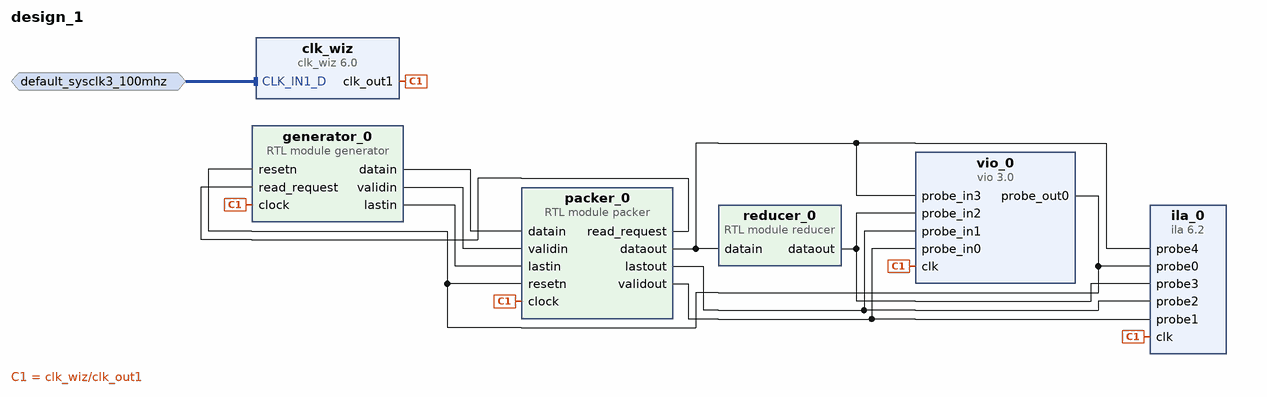
[diagram p0: block diagram of the top level]
# Vivado block design design_1, xczu28dr-ffvg1517-2-e, Vivado 2019.2
create_bd_design design_1

create_bd_intf_port -mode Slave -vlnv xilinx.com:interface:diff_clock_rtl:1.0 default_sysclk3_100mhz
set_property -dict {CONFIG.FREQ_HZ 100000000} [get_bd_intf_ports default_sysclk3_100mhz]

create_bd_cell -type ip -vlnv xilinx.com:ip:ila:6.2 ila_0
set_property -dict [list \
  CONFIG.C_ENABLE_ILA_AXI_MON false \
  CONFIG.C_MONITOR_TYPE Native \
  CONFIG.C_NUM_OF_PROBES 5 \
  CONFIG.C_PROBE3_WIDTH 4 \
  CONFIG.C_PROBE4_WIDTH 32 \
] [get_bd_cells ila_0]
create_bd_cell -type ip -vlnv xilinx.com:ip:clk_wiz:6.0 clk_wiz
set_property -dict [list \
  CONFIG.CLK_IN1_BOARD_INTERFACE default_sysclk3_100mhz \
  CONFIG.RESET_PORT resetn \
  CONFIG.RESET_TYPE ACTIVE_LOW \
  CONFIG.USE_BOARD_FLOW true \
  CONFIG.USE_LOCKED false \
  CONFIG.USE_RESET false \
] [get_bd_cells clk_wiz]
create_bd_cell -type module -reference packer packer_0
create_bd_cell -type module -reference generator generator_0
create_bd_cell -type ip -vlnv xilinx.com:ip:vio:3.0 vio_0
set_property -dict {CONFIG.C_EN_PROBE_IN_ACTIVITY 1 CONFIG.C_NUM_PROBE_IN 4} [get_bd_cells vio_0]
create_bd_cell -type module -reference reducer reducer_0

# ---- connections ----

connect_bd_intf_net [get_bd_intf_ports default_sysclk3_100mhz] [get_bd_intf_pins clk_wiz/CLK_IN1_D]
connect_bd_net [get_bd_pins clk_wiz/clk_out1] \
  [get_bd_pins ila_0/clk] [get_bd_pins packer_0/clock] [get_bd_pins generator_0/clock] [get_bd_pins vio_0/clk]
connect_bd_net [get_bd_pins generator_0/datain] [get_bd_pins packer_0/datain]
connect_bd_net [get_bd_pins generator_0/validin] [get_bd_pins packer_0/validin]
connect_bd_net [get_bd_pins generator_0/lastin] [get_bd_pins packer_0/lastin]
connect_bd_net [get_bd_pins packer_0/read_request] [get_bd_pins generator_0/read_request]
connect_bd_net [get_bd_pins packer_0/dataout] [get_bd_pins ila_0/probe4] [get_bd_pins vio_0/probe_in3] [get_bd_pins reducer_0/datain]
connect_bd_net [get_bd_pins vio_0/probe_out0] [get_bd_pins generator_0/resetn] [get_bd_pins packer_0/resetn] [get_bd_pins ila_0/probe0]
connect_bd_net [get_bd_pins reducer_0/dataout] [get_bd_pins ila_0/probe3] [get_bd_pins vio_0/probe_in2]
connect_bd_net [get_bd_pins packer_0/lastout] [get_bd_pins ila_0/probe2] [get_bd_pins vio_0/probe_in1]
connect_bd_net [get_bd_pins packer_0/validout] [get_bd_pins ila_0/probe1] [get_bd_pins vio_0/probe_in0]

validate_bd_design
save_bd_design
